# EAGLE design NX Baseboard - PCIe M2 - CR69Z2 (EAGLE 9.5.2)
REV: CR69Z2; TITLE: NX Baseboard : PCIe m2; URL: https://github.com/CapableRobot/NX-Baseboard-Expansion_PCIE-M2
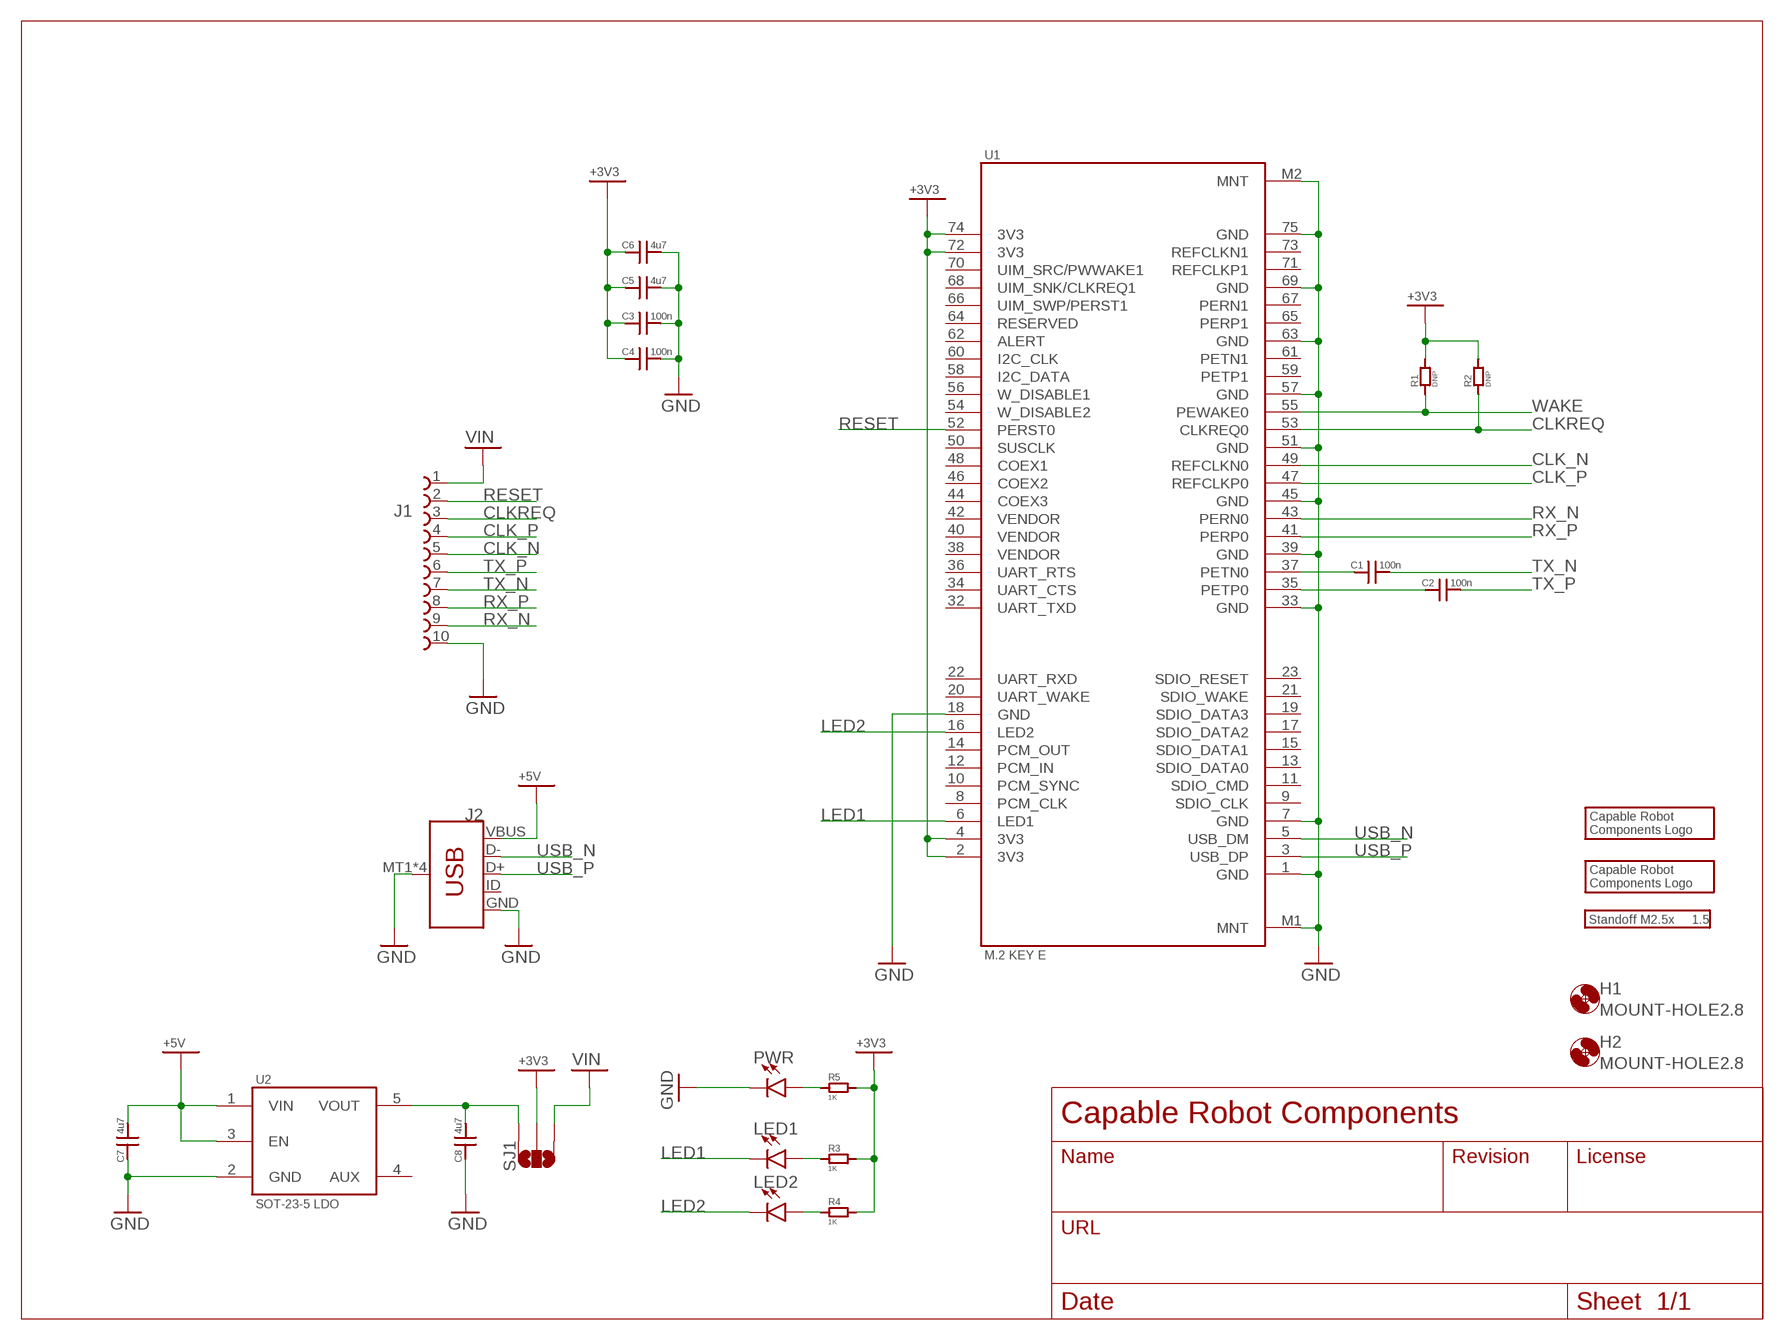
[diagram p0: schematic, sheet 1]

## Parts
C1  100n  CAP0402  [0402]
C2  100n  CAP0402  [0402]
C3  100n  CAP0402  [0402]
C4  100n  CAP0402  [0402]
C5  4u7  CAP0805  [0805]
C6  4u7  CAP0805  [0805]
C7  4u7  CAP0805  [0805]
C8  4u7  CAP0805  [0805]
H1  MOUNT-HOLE2.8  [2,8]
H2  MOUNT-HOLE2.8  [2,8]
J1  68711014522  [68711014522]
J2  USB_MICRO-B_SMT  [USB-MICROB]
LED1  LED0603  [LED-0603]
LED2  LED0603  [LED-0603]
LOGO1  CRC-LOGO10SILK  [CRC-LOGO-10-SILK]
LOGO2  CRC-LOGO5SILK  [CRC-LOGO-5-SILK]
M1  1.5  STANDOFF-M25  [STANDOFF-M25]
PWR  LED0603  [LED-0603]
R1  DNP  RES0603NC  [0603NOCREAM]
R2  DNP  RES0603NC  [0603NOCREAM]
R3  1K  RES0603  [0603]
R4  1K  RES0603  [0603]
R5  1K  RES0603  [0603]
SJ1  JUMPER-PAD-3-NOYES_SILK  [PAD-JUMPER-3-NO_YES_SILK]
U1  M2-KEYE  [TE-2199119-KEYE]
U2  MIC20XX  [SOT25]

## Nets
+3V3: C3.1 C4.1 C5.1 C6.1 R1.2 R2.2 R3.2 R4.2 R5.2 SJ1.2 U1.2(3V3) U1.4(3V3) U1.72(3V3) U1.74(3V3)
+5V [diff]: C7.2 J2.VBUS U2.1(VIN) U2.3(EN)
CLK_N [diff]: J1.5 U1.49(REFCLKN0)
CLK_P [diff]: J1.4 U1.47(REFCLKP0)
CLKREQ: J1.3 R2.1 U1.53(CLKREQ0)
GND: C3.2 C4.2 C5.2 C6.2 C7.1 C8.1 J1.10 J2.GND J2.MT1(SHIELD) J2.MT2(SHIELD) J2.P$1(SHIELD) J2.P$2(SHIELD) PWR.C U1.1(GND) U1.7(GND) U1.18(GND) U1.33(GND) U1.39(GND) U1.45(GND) U1.51(GND) U1.57(GND) U1.63(GND) U1.69(GND) U1.75(GND) U1.M1(MNT) U1.M2(MNT) U2.2(GND)
LED1: LED1.C U1.6(LED1)
LED2: LED2.C U1.16(LED2)
M2_TX_N [diff]: C1.1 U1.37(PETN0)
M2_TX_P [diff]: C2.1 U1.35(PETP0)
N$2: LED1.A R3.1
N$3: LED2.A R4.1
N$4: PWR.A R5.1
RESET: J1.2 U1.52(PERST0)
RX_N [diff]: J1.9 U1.43(PERN0)
RX_P [diff]: J1.8 U1.41(PERP0)
TX_N [diff]: C1.2 J1.7
TX_P [diff]: C2.2 J1.6
USB_N [diff]: J2.D- U1.5(USB_DM)
USB_P [diff]: J2.D+ U1.3(USB_DP)
VIN: J1.1 SJ1.1
VREG: C8.2 SJ1.3 U2.5(VOUT)
WAKE: R1.1 U1.55(PEWAKE0)
Unconnected: J2.ID U1.8(PCM_CLK) U1.9(SDIO_CLK) U1.10(PCM_SYNC) U1.11(SDIO_CMD) U1.12(PCM_IN) U1.13(SDIO_DATA0) U1.14(PCM_OUT) U1.15(SDIO_DATA1) U1.17(SDIO_DATA2) U1.19(SDIO_DATA3) U1.20(UART_WAKE) U1.21(SDIO_WAKE) U1.22(UART_RXD) U1.23(SDIO_RESET) U1.32(UART_TXD) U1.34(UART_CTS) U1.36(UART_RTS) U1.38(VENDOR) U1.40(VENDOR) U1.42(VENDOR) U1.44(COEX3) U1.46(COEX2) U1.48(COEX1) U1.50(SUSCLK) U1.54(W_DISABLE2) U1.56(W_DISABLE1) U1.58(I2C_DATA) U1.59(PETP1) U1.60(I2C_CLK) U1.61(PETN1) U1.62(ALERT) U1.64(RESERVED) U1.65(PERP1) U1.66(UIM_SWP/PERST1) U1.67(PERN1) U1.68(UIM_SNK/CLKREQ1) U1.70(UIM_SRC/PWWAKE1) U1.71(REFCLKP1) U1.73(REFCLKN1) U2.4(AUX)

## Library data of the parts
C1-C8 = CapableRobot:CAP
H1 H2 = holes:MOUNT-HOLE: MOUNTING HOLE with drill center marker
J1 = Wurth_Elektronik_Electromechanic_FPC_Connectors_&_Flat_Flexible_Cable_rev18c:68711014522: WR-FPC 0.5mm SMT ZIF Horizontal Bottom Contact, 10 Pins=>Code : Con_FPC_ZIF_0.50_68711014522 <http://katalog.we-online.de/media/images/eican/Con_FPC_ZIF_0.50_6871xx14522_pf2.jpg> Details see: http://katalog.we-online.de/en/em/687_1xx_145_22 Created 2014-07-09, Karrer Zheng 2014 (C) Würth Elektronik
J2 = CapableRobot:USB_MICRO-B: USB Type Micro-B Connector Male/female and PTH/SMT variants SparkFun Products: SparkFun microB USB Breakout <https://www.sparkfun.com/products/12035> SparkFun USB microB Plug Breakout <https://www.sparkfun.com/products/10031> SparkFun ESP8266 Thing <https://www.sparkfun.com/products/13231>; PROD_ID: CONN-09505; SF_ID: PRT-08533
LED1 LED2 PWR = SparkFun-LED:LED: LED (Generic) Standard schematic elements and footprints for 5mm, 3mm, 1206, and 0603 sized LEDs. Generic LEDs with no color specified.
LOGO1 LOGO2 = CapableRobot:CRC-LOGO
M1 = CapableRobot:STANDOFF-M25; MPN: 9774015151R
R1-R5 = CapableRobot:RES
SJ1 = CapableRobot:JUMPER-PAD-3-NO
U1 = CapableRobot:M2-KEYE; MPN: 2199119-4
U2 = CapableRobot:MIC20XX

## Net classes
1 diff: width 0.249 mm, drill 0.254 mm, clearance 0.249 mm

## Board
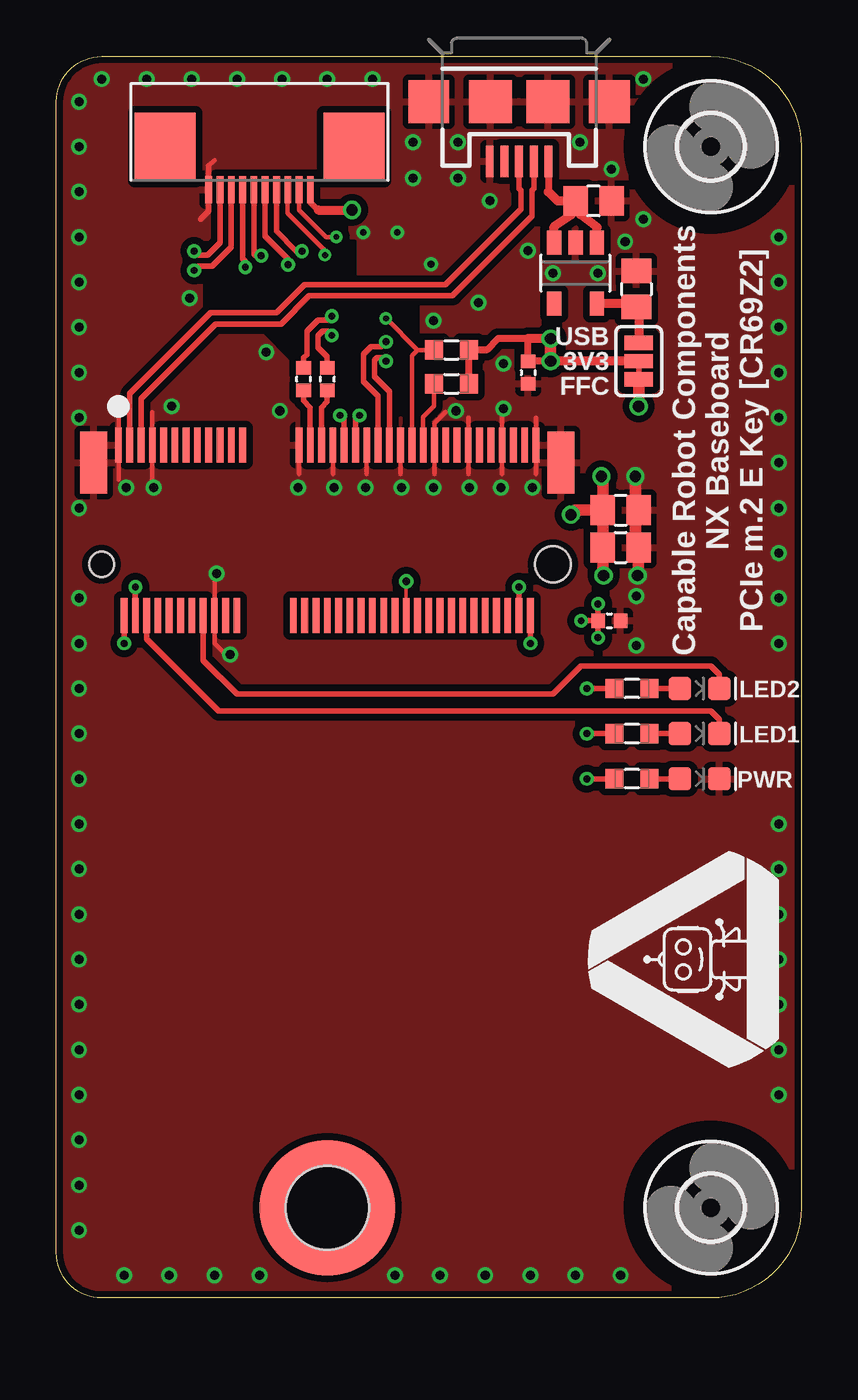
[diagram p1: board, top side]
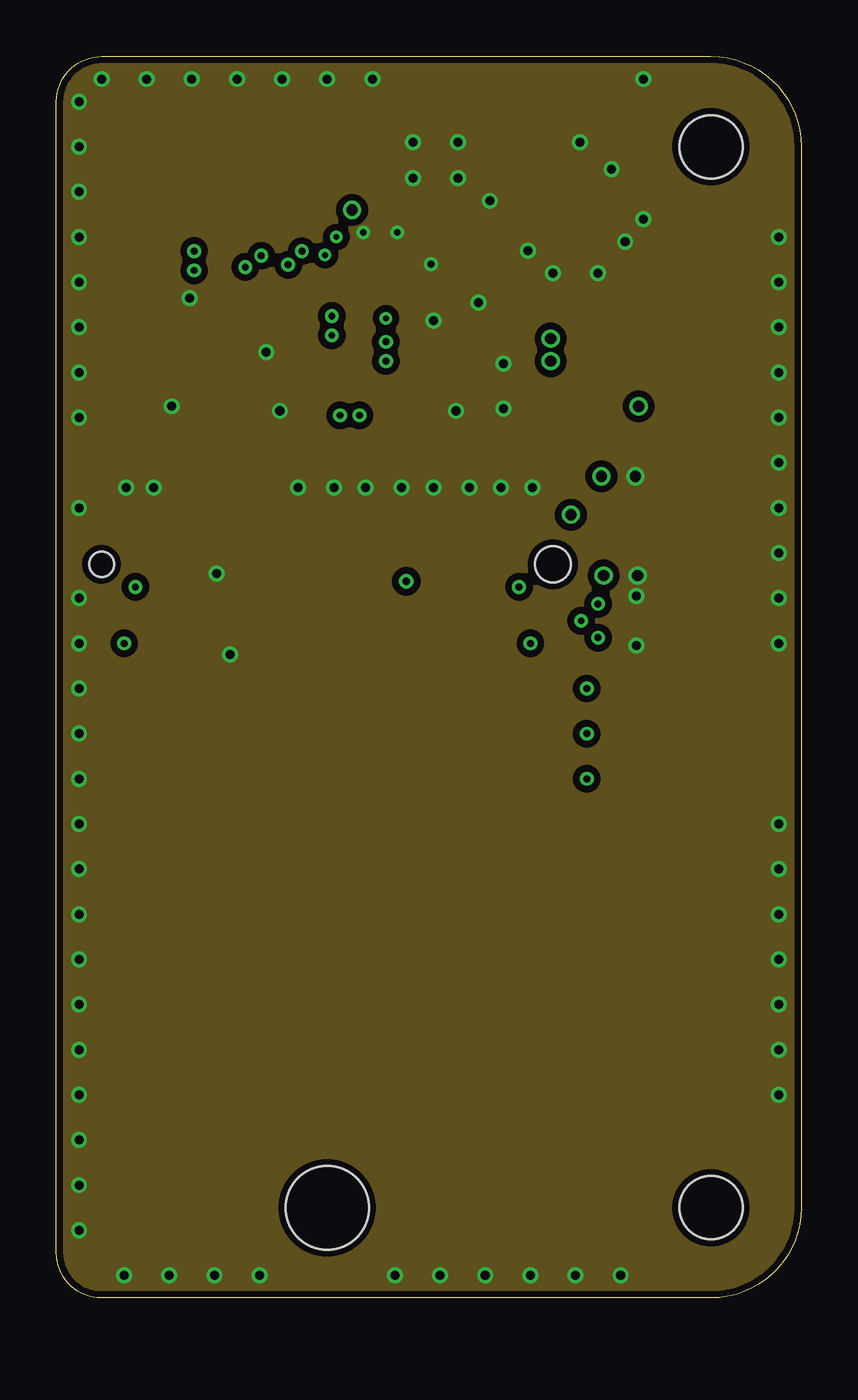
[diagram p2: board, inner layer Route2]
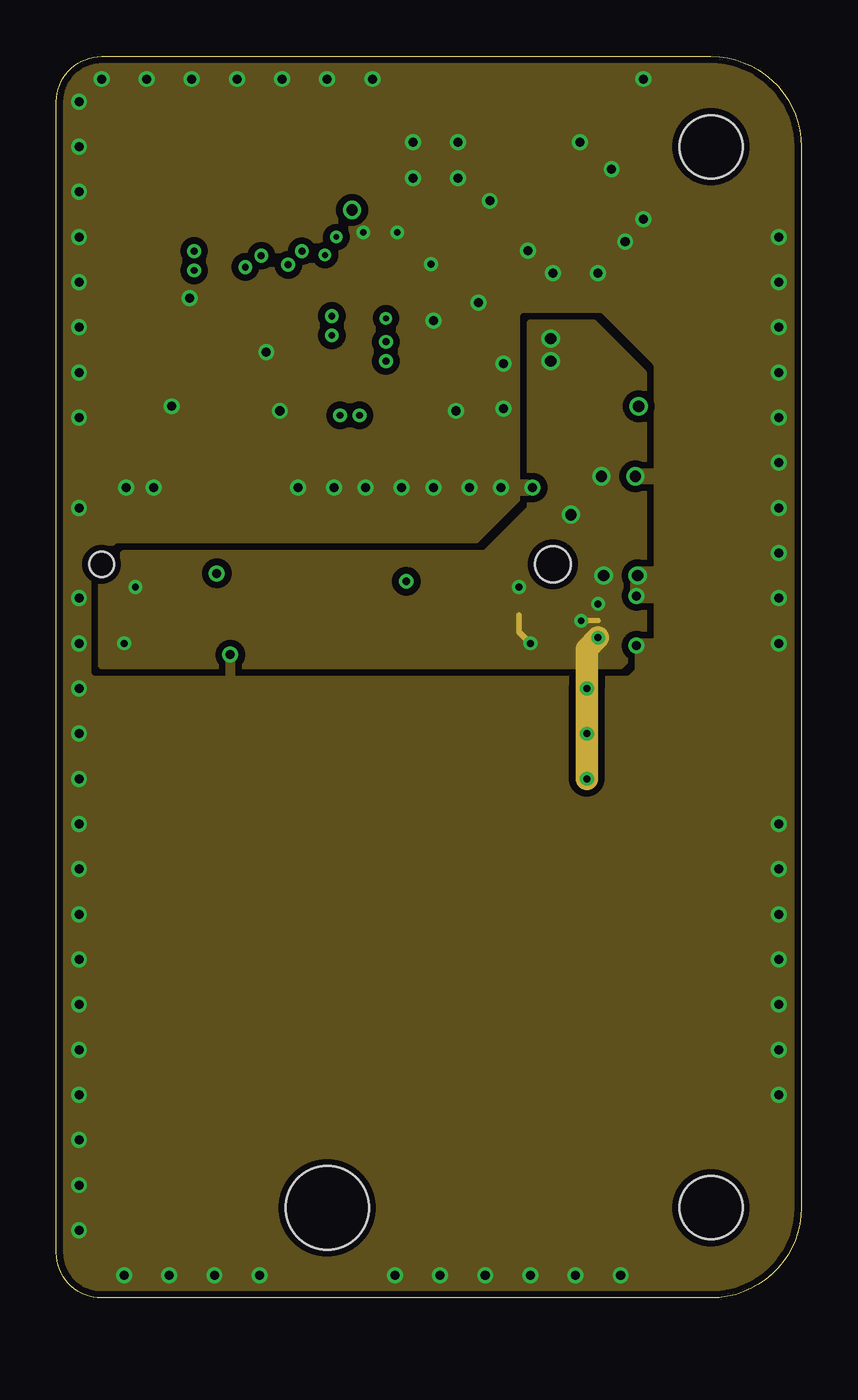
[diagram p3: board, inner layer Route15]
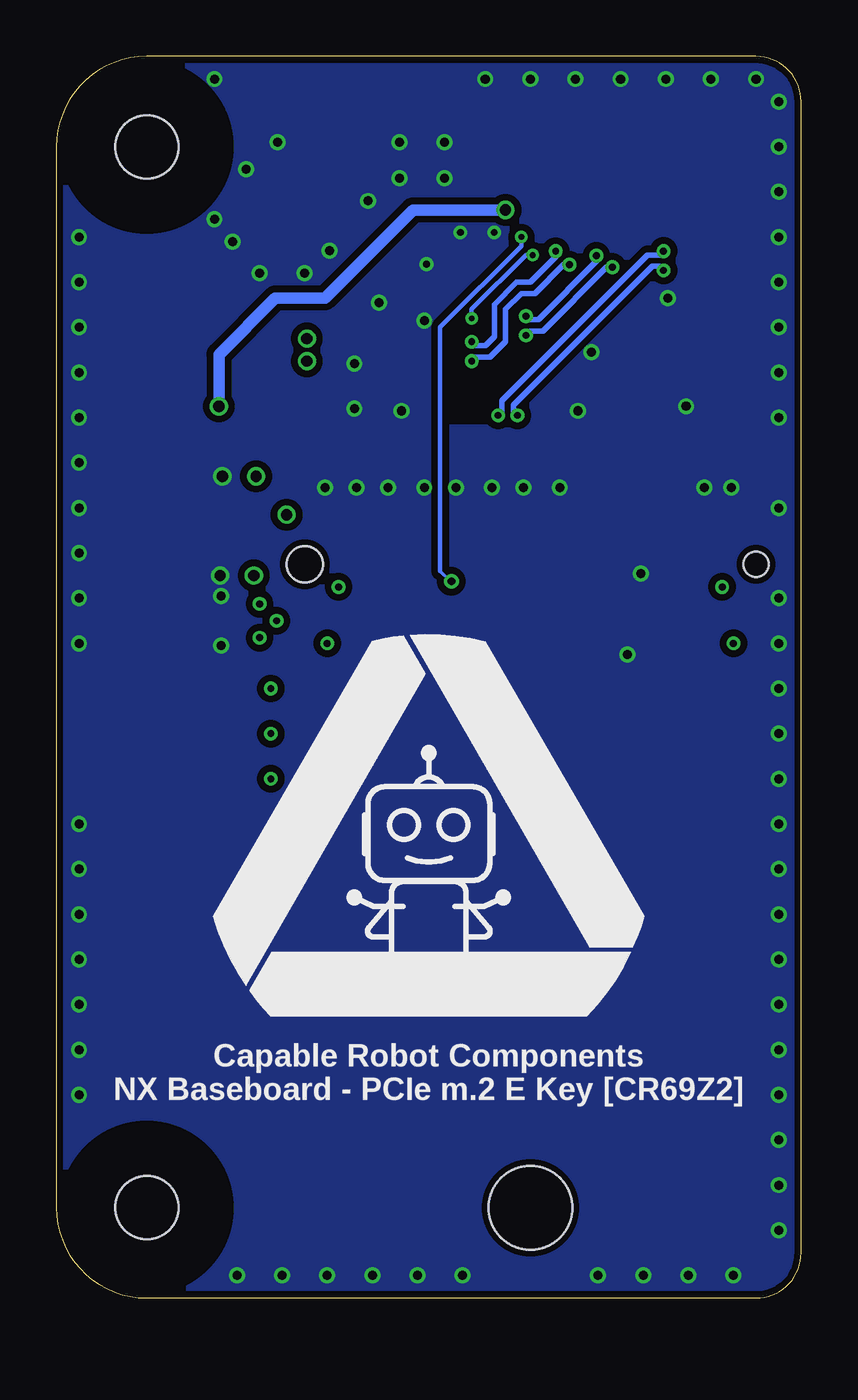
[diagram p4: board, bottom side, seen from below]

Size 33 x 55 mm. Coordinates in mm from the lower left corner, seen from the top.
Outline: 2,55 29,55 arc-90 33,51 33,4 arc-90 29,0 2,0 arc-90 0,2 0,53 arc-90 2,55
Copper layers (1*2*15*16): Top 0.035mm / dielectric 0.23mm / Route2 0.035mm / dielectric 0.93mm / Route15 0.035mm / dielectric 0.23mm / Bottom 0.035mm
Design rules "MF_Standard_4_Layer *": minimum track width 5mil, minimum drill 10mil, track to track 5mil, track to pad 5mil, pad to pad 5mil, via to via 5mil, smd to smd 0mil, copper to edge 10mil, drill to drill 10mil, minimum pad ring 6mil, minimum via ring 6mil, stop-mask expansion 2mil, vias tented up to drill 25mil, thermal gap 10mil

### Footprints (pad centres in the part's own frame; a part is rotated, then mirrored left to right if it is on the bottom)
0402 = smd 0.6 x 0.65: 1 -0.5,0; 2 0.5,0
0805 = smd 1.079 x 1.321: 1 -0.794,0; 2 0.794,0
2,8 = hole 2.8: 0,0
68711014522 = smd 0.3 x 1.2: 1 -2.25,1.9; 2 -1.75,1.9; 3 -1.25,1.9; 4 -0.75,1.9; 5 -0.25,1.9; 6 0.25,1.9; 7 0.75,1.9; 8 1.25,1.9; 9 1.75,1.9; 10 2.25,1.9 | smd 2.7 x 3: Z1 -4.18,0; Z2 4.18,0
USB-MICROB = smd 1.4 x 0.35: D+ -2.65,0; D- -2.65,-0.65; GND -2.65,1.3; ID -2.65,0.65; VBUS -2.65,-1.3 | smd 1.9 x 1.8: MT1 0,-4; MT2 0,4 | smd 1.9 x 1.9: P$1 0,-1.27; P$2 0,1.27
LED-0603 = smd 1 x 1: A -0.877,0; C 0.877,0
STANDOFF-M25 = smd 6 x 6: P$1 0,0 | hole 3.7: 0,0
0603NOCREAM = smd 0.79 x 0.86: 1 -0.775,0; 2 0.775,0
0603 = smd 0.79 x 0.86: 1 -0.775,0; 2 0.775,0
PAD-JUMPER-3-NO_YES_SILK = smd 0.635 x 1.27: 1 -0.813,0; 2 0,0; 3 0.813,0
TE-2199119-KEYE = smd 0.3 x 1.55: 1 -9.25,3.775; 2 -9,-3.775; 3 -8.75,3.775; 4 -8.5,-3.775; 5 -8.25,3.775; 6 -8,-3.775; 7 -7.75,3.775; 8 -7.5,-3.775; 9 -7.25,3.775; 10 -7,-3.775; 11 -6.75,3.775; 12 -6.5,-3.775; 13 -6.25,3.775; 14 -6,-3.775; 15 -5.75,3.775; 16 -5.5,-3.775; 17 -5.25,3.775; 18 -5,-3.775; 19 -4.75,3.775; 20 -4.5,-3.775; 21 -4.25,3.775; 22 -4,-3.775; 23 -3.75,3.775; 32 -1.5,-3.775; 33 -1.25,3.775; 34 -1,-3.775; 35 -0.75,3.775; 36 -0.5,-3.775; 37 -0.25,3.775; 38 0,-3.775; 39 0.25,3.775; 40 0.5,-3.775; 41 0.75,3.775; 42 1,-3.775; 43 1.25,3.775; 44 1.5,-3.775; 45 1.75,3.775; 46 2,-3.775; 47 2.25,3.775; 48 2.5,-3.775; 49 2.75,3.775; 50 3,-3.775; 51 3.25,3.775; 52 3.5,-3.775; 53 3.75,3.775; 54 4,-3.775; 55 4.25,3.775; 56 4.5,-3.775; 57 4.75,3.775; 58 5,-3.775; 59 5.25,3.775; 60 5.5,-3.775; 61 5.75,3.775; 62 6,-3.775; 63 6.25,3.775; 64 6.5,-3.775; 65 6.75,3.775; 66 7,-3.775; 67 7.25,3.775; 68 7.5,-3.775; 69 7.75,3.775; 70 8,-3.775; 71 8.25,3.775; 72 8.5,-3.775; 73 8.75,3.775; 74 9,-3.775; 75 9.25,3.775 | smd 1.2 x 2.75: M1 -10.35,3; M2 10.35,3 | hole 1.1: -10,-1.5 | hole 1.6: 10,-1.5
SOT25 = smd 0.635 x 1.067: 1 -0.95,-1.346; 2 0,-1.346; 3 0.95,-1.346; 4 0.95,1.346; 5 -0.95,1.346

### Placement (x,y rotation side)
C1  12,40.7 90 top
C2  10.95,40.7 90 top
C3  20.9,41 270 top
C4  24.5,30 0 top
C5  25,34.9 0 top
C6  25,33.25 0 top
C7  23.8,48.6 180 top
C8  25.7,44.7 270 top
H1  29,51 0 top
H2  29,4 0 top
J1  9,51 180 top
J2  20.5,53 90 top
LED1  28.5,25 0 top
LED2  28.5,27 0 top
LOGO1  16.5,19.5 0 bottom
LOGO2  28.5,15 90 top
M1  12,4 0 top
PWR  28.5,23 0 top
R1  17.5,40.5 0 top
R2  17.5,42 0 top
R3  25.5,25 180 top
R4  25.5,27 180 top
R5  25.5,23 180 top
SJ1  25.8,41.5 90 top
U1  12,34 0 top
U2  23,45.4 180 top

### Tracks (layer width: path | path; a pad name or v marks a point on that pad's centre or on a via)
+3V3  (via drill 0.3, 0.5)
  Top 0.25: 21.02,30.25 U1.74 v21,29 | U1.4 v3.5,31.5 | U1.2 v3,29 | U1.72 v20.5,31.5 | v23.25,30 C4.1 | C4.1 v24,29.25 | C4.1 v24,30.75 | R4.2 v23.5,27 | R3.2 v23.5,25 | R5.2 v23.5,23 | SJ1.2 25.8,40.7
  Top 0.3: R1.2 R2.2 19.07,42 19.57,42.5 20.9,42.5 C3.1 v21.9,41.5
  Top 0.4: v21.9,42.5 20.9,42.5 | SJ1.2 v21.9,41.5
  Top 0.5: v24.25,32 24.21,32.04 C6.1 C5.1 | v24.15,36.4 24.21,36.34 C5.1 | C5.1 23,34.9 v22.8,34.7 | v21.9,42.5 v21.9,41.5
  Route15 0.25: v21,29 20.5,29.5 20.5,30.25 | v23.25,30 C4.1
  Route15 1: v23.5,23 v23.5,25 v23.5,27 23.5,28.75 v24,29.25
  pour Route15 (isolate 0.3): 21,43.2 23.8,43.2 26,41 26,29 25,28 2,28 2,32 3,33 19,33 21,35
+5V
  Top 0.3: J2.VBUS 21.8,49 | 22.81,48.4 C7.2
  Top 0.4: U2.1 23.95,47.43 23.21,48.01 23.21,48.4 C7.2 22.2,48.6 21.8,49 | U2.3 22.05,47.45 22.81,47.98 22.81,48.4
CLK_N  (via drill 0.3)
  Top 0.25: U1.49 14.75,39.05 14.75,40.16 14.1,40.81 14.1,41.55 14.2,41.65 14.45,41.65 v14.6,41.5 | J1.5 9.25,48 9.25,47.04 10.27,46.02 v10.27,45.77
  Bottom 0.25: v10.27,45.77 10.52,45.77 11.79,44.5 12.4,44.5 13.1,43.8 13.1,42.37 13.79,41.68 14.42,41.68 v14.6,41.5
CLK_P  (via drill 0.3)
  Top 0.25: U1.47 14.25,39.05 14.25,39.95 13.6,40.6 13.6,41.81 13.94,42.15 14.39,42.15 v14.6,42.36 | J1.4 9.75,48 9.75,47.25 10.62,46.38 v10.88,46.38
  Bottom 0.25: v10.88,46.38 10.88,46.12 12,45 12.61,45 13.6,44.01 13.6,42.58 14,42.18 14.42,42.18 v14.6,42.36
CLKREQ  (via drill 0.25)
  Top 0.2: J1.3 10.25,48.05 11.9,46.4 v11.9,46.2 | R2.1 16,42 | 16,42 v14.6,43.4 | 16,42 15.75,41.75 U1.53
  Bottom 0.2: v14.6,43.4 14.6,43.8 12.2,46.2 v11.9,46.2
GND  (via drill 0.3, 0.4, 0.5)
  Top 0.2: 7,31.75 U1.18 7,29 7.5,28.5 | 4.25,36.25 U1.7 4.25,39.25 | 2.75,36.25 U1.1 2.75,39.25 | U1.33 10.75,36.5 | U1.39 12.25,36.5 | U1.45 13.75,36.5 | U1.51 15.25,36.5 | 16.75,36.5 U1.57 16.75,38.75 17.25,39.25 | 18.25,36.5 U1.63 18.25,39 | 19.75,36.5 U1.69 19.75,39.25 | 21.25,36.5 U1.75 21.25,39 | 6.75,50.15 7,50.4
  Top 0.25: 6.4,47.8 6.75,48.15 J1.10 6.75,50.15
  Top 0.5: v25.65,36.4 25.65,33.39 C6.2 25.79,32.04 v25.75,32
  other vias: 24.6,50 26,47.8 25.2,46.8 24,45.4 22,45.4 23.2,51.2 17.8,51.2 15.8,51.2 15.8,49.6 19.2,48.6 17.8,49.6 16.7,43.3 3.1,35.9 4.3,35.9 10.7,35.9 12.3,35.9 13.7,35.9 15.3,35.9 16.7,35.9 18.3,35.9 19.7,35.9 21.1,35.9 17.7,39.3 9.3,41.9 5.1,39.5 9.9,39.3 5.9,44.3 7.1,32.1 7.7,28.5 25.7,28.9 25.7,31.1 1,53 2,54 1,51 1,49 1,47 1,45 1,43 1,41 1,39 1,35 1,31 1,29 1,27 1,25 1,23 1,21 1,19 1,17 1,15 1,13 1,11 1,9 1,7 1,5 1,3 3,1 5,1 7,1 9,1 15,1 17,1 19,1 21,1 23,1 25,1 32,9 32,11 32,13 32,15 32,17 32,19 32,21 32,29 32,31 32,33 32,35 32,37 32,39 32,41 32,43 32,45 32,47 4,54 6,54 8,54 10,54 12,54 14,54 26,54 15.1,47.2 13.6,47.2 19.8,39.4 16.6,45.8 18.7,44.1 20.9,46.4 19.8,41.4
  pour Top (isolate 0.3): 0,55 33,55 33,0 0,0
  pour Route2 (isolate 0.3): 0,55 33,55 33,0 0,0
  pour Route15 (isolate 0.3, rank 6): 0,55 33,55 33,0 0,0
  pour Bottom (isolate 0.3): 0,55 33,55 33,0 0,0
ISO
  cutout Bottom (isolate 0.3): 13.8,38.8 15.6,38.8 15.6,39.2 13.8,39.2
  cutout Top (isolate 0.3): 16,44.2 16,42.4 15.6,42.4 15.6,44.2
  cutout Top (isolate 0.3): 7,45.4 7,43.6 6.6,43.6 6.6,45.4
  cutout Top (isolate 0.3): 13.2,46.8 13.2,45 12.8,45 12.8,46.8
  cutout Top (isolate 0.3): 9.45,43.13 10.73,41.85 10.44,41.57 9.17,42.84
LED1
  Top 0.25: U1.6 4,29.19 7.19,26 29,26 29.38,25.62 LED1.C
LED2
  Top 0.25: LED2.C 29.38,27.62 29,28 23.25,28 22,26.75 8,26.75 6.5,28.25 U1.16
M2_TX_N
  Top 0.25: U1.37 11.75,39.05 11.75,39.45 12,39.7 C1.1
M2_TX_P
  Top 0.25: U1.35 11.25,39.45 10.95,39.75 C2.1
N$2
  Top 0.25: LED1.A R3.1
N$3
  Top 0.25: LED2.A R4.1
N$4
  Top 0.25: PWR.A R5.1
RESET  (via drill 0.25, 0.35)
  Top 0.152: v15.5,31.75 U1.52
  Top 0.2: J1.2 10.75,48.2 11.95,47 v12.4,47
  Bottom 0.152: v15.5,31.75 15.55,31.75 16,32.2
  Bottom 0.2: 16,32.2 16,43 12.4,46.6 v12.4,47
RX_N  (via drill 0.3)
  Top 0.25: U1.43 13.25,38.92 v13.43,39.1 | v6.1,46.38 6.28,46.2 6.7,46.2 7.25,46.75 J1.9
  Bottom 0.25: v13.43,39.1 13.25,39.28 13.25,39.76 6.81,46.2 6.28,46.2 v6.1,46.38
RX_P  (via drill 0.3)
  Top 0.25: U1.41 12.75,38.92 v12.57,39.1 | v6.1,45.52 6.28,45.7 6.91,45.7 7.75,46.54 J1.8
  Bottom 0.25: v12.57,39.1 12.75,39.28 12.75,39.55 6.6,45.7 6.28,45.7 v6.1,45.52
TX_N  (via drill 0.3)
  Top 0.25: J1.7 8.25,48 8.25,46.04 8.37,45.92 v8.37,45.67 | v12.2,42.64 12.02,42.82 11.8,42.82 11.6,42.62 11.6,42.1 12,41.7 C1.2
  Bottom 0.25: v8.37,45.67 8.62,45.67 11.45,42.84 12,42.84 v12.2,42.64
TX_P  (via drill 0.3)
  Top 0.25: J1.6 8.75,48 8.75,46.25 8.82,46.18 v9.08,46.18 | v12.2,43.5 12.02,43.32 11.59,43.32 11.1,42.83 11.1,41.8 10.95,41.65 C2.2
  Bottom 0.25: v9.08,46.18 9.08,45.92 11.65,43.35 12.05,43.35 v12.2,43.5
USB_N
  Top 0.25: J2.D- 21.15,49.15 21.07,49.07 21.07,47.92 17.56,44.4 11.21,44.4 9.96,43.15 7.05,43.15 3.75,39.85 3.75,39.05 U1.5
USB_P
  Top 0.25: J2.D+ 20.5,49.15 20.58,49.07 20.58,48.23 17.25,44.9 11,44.9 9.75,43.65 6.84,43.65 3.25,40.06 3.25,39.05 U1.3
VIN  (via drill 0.5)
  Top 0.25: J1.1 11.25,48.55 11.6,48.2
  Top 0.4: 11.6,48.2 v13.1,48.2
  Top 0.5: v25.8,39.5 SJ1.1
  Bottom 0.5: v13.1,48.2 17.2,48.2 21.1,44.3 23.3,44.3 25.8,41.8 v25.8,39.5
VREG
  Top 0.4: U2.5 25.55,44.05 C8.2 25.8,43.81 SJ1.3
WAKE
  Top 0.2: U1.55 16.25,39.02 16.73,39.5 R1.1

### Text on the board
tPlace: USB | 3V3 | FFC | Capable Robot Components / NX Baseboard / PCIe m.2 E Key [CR69Z2]
bPlace: Capable Robot Components / NX Baseboard - PCIe m.2 E Key [CR69Z2]